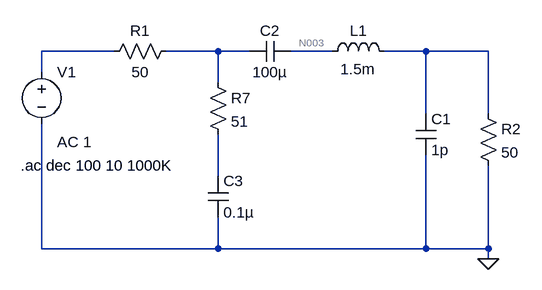
[diagram p0: schematic LP_Audio.asc]
LP_Audio.asc, the LTspice schematic file:
Version 4
SHEET 1 880 680
WIRE -48 128 -160 128
WIRE 112 128 32 128
WIRE 160 128 112 128
WIRE 288 128 224 128
WIRE 432 128 368 128
WIRE 528 128 432 128
WIRE -160 160 -160 128
WIRE 112 176 112 128
WIRE 432 224 432 128
WIRE 528 224 528 128
WIRE 112 320 112 256
WIRE -160 432 -160 240
WIRE 112 432 112 384
WIRE 112 432 -160 432
WIRE 432 432 432 288
WIRE 432 432 112 432
WIRE 528 432 528 304
WIRE 528 432 432 432
WIRE 528 448 528 432
FLAG 528 448 0
SYMBOL ind 272 144 R270
WINDOW 0 32 56 VTop 2
WINDOW 3 4 55 VBottom 2
SYMATTR InstName L1
SYMATTR Value 1.5m
SYMBOL voltage -160 144 R0
WINDOW 123 24 124 Left 2
WINDOW 39 0 0 Left 0
SYMATTR Value2 AC 1
SYMATTR InstName V1
SYMATTR Value ""
SYMBOL res 48 112 R90
WINDOW 0 0 56 VBottom 2
WINDOW 3 32 56 VTop 2
SYMATTR InstName R1
SYMATTR Value 50
SYMBOL res 512 208 R0
SYMATTR InstName R2
SYMATTR Value 50
SYMBOL cap 96 320 R0
SYMATTR InstName C3
SYMATTR Value 0.1µ
SYMBOL res 96 160 R0
SYMATTR InstName R7
SYMATTR Value 51
SYMBOL cap 416 224 R0
SYMATTR InstName C1
SYMATTR Value 1p
SYMBOL cap 224 112 R90
WINDOW 0 0 32 VBottom 2
WINDOW 3 32 32 VTop 2
SYMATTR InstName C2
SYMATTR Value 100µ
TEXT -192 304 Left 2 !.ac dec 100 10 1000K

The netlist it stands for:
* LP_Audio.asc
L1 N003 N004 1.5m
V1 N001 0 AC 1
R1 N002 N001 50
R2 N004 0 50
C3 N005 0 0.1µ
R7 N002 N005 51
C1 N004 0 1p
C2 N003 N002 100µ
.ac dec 100 10 1000K
.backanno
.end

* Results of the author's LTspice run, read from the files saved beside the schematic
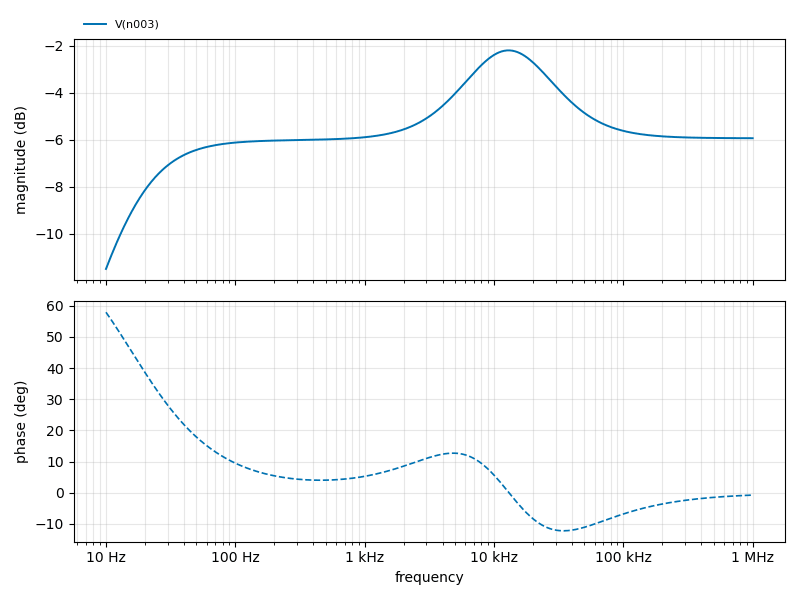
[diagram p1: AC Analysis of LP_Audio.asc, plotted from the saved traces]
* AC Analysis, 1 run:
*   V(n003): -11.50 dB at 10 Hz, -5.93 dB at 1 MHz, peak -2.19 dB at 12.88 kHz, 3 dB below the peak at 2.773 kHz and 62.95 kHz